# EAGLE schematic OpenPLC (EAGLE 6.5.0)
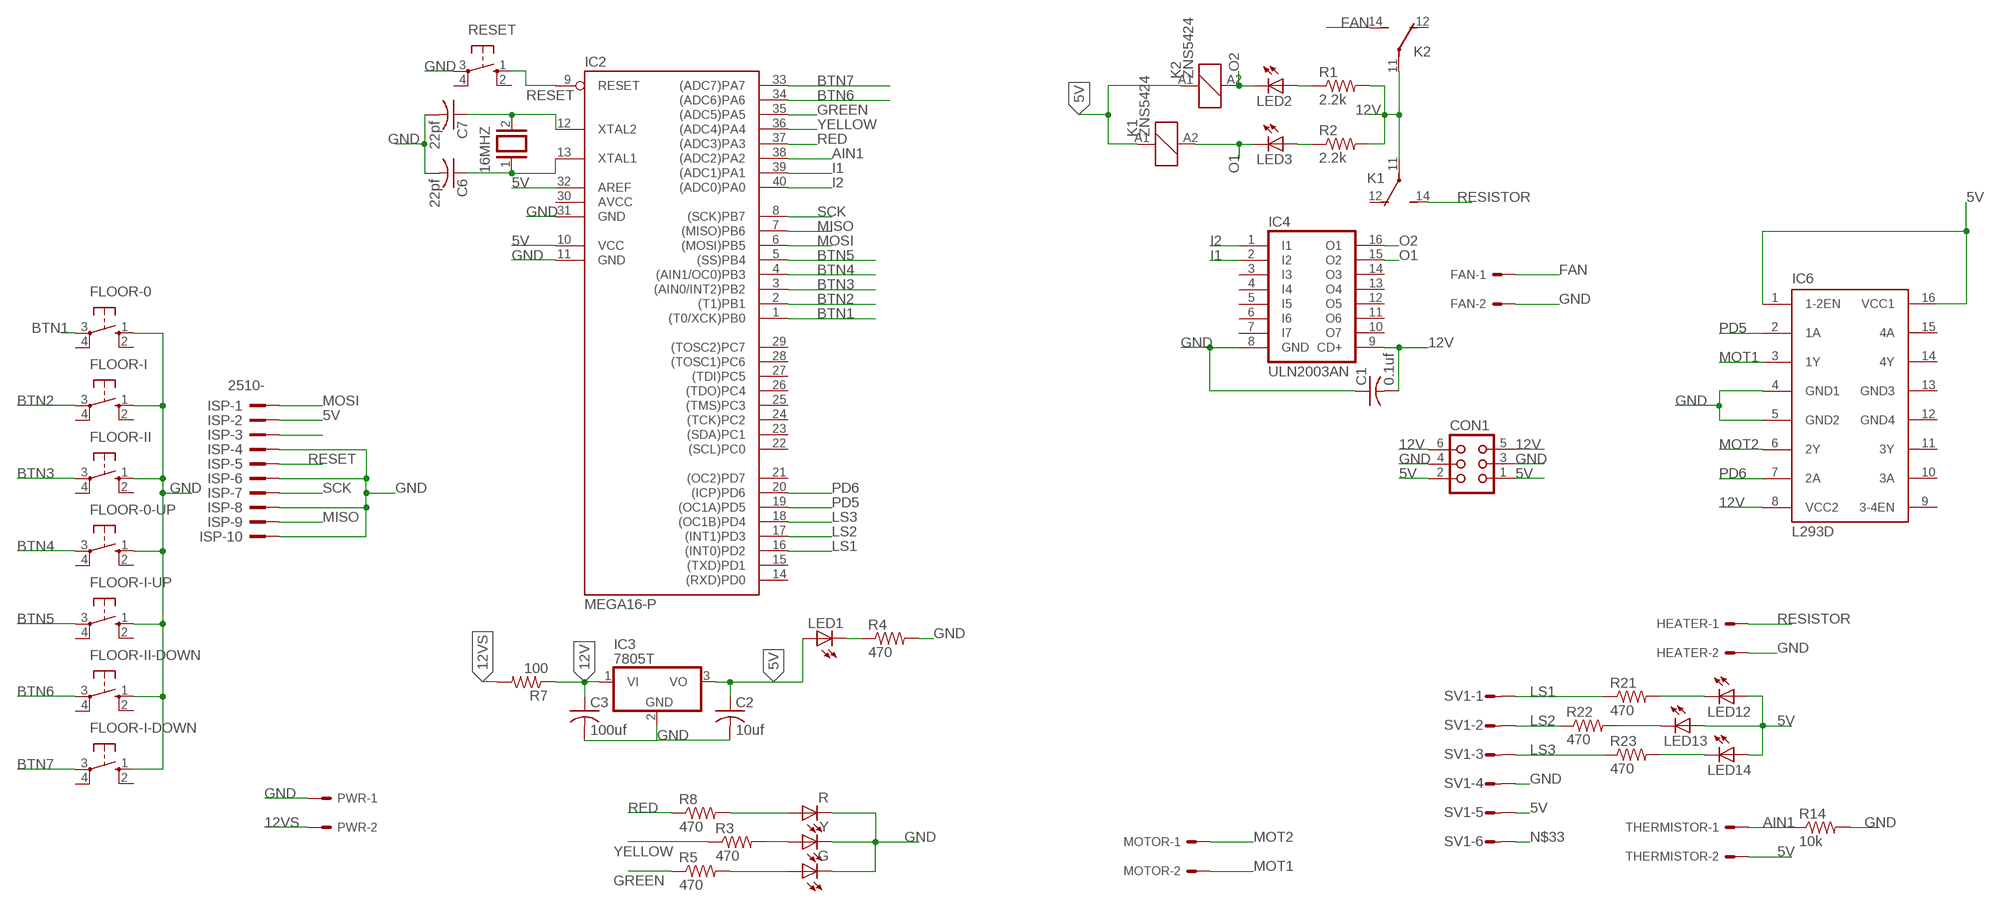
[diagram p0: schematic, sheet 1]

## Parts
16MHZ  XTAL/S  [QS]
C1  0.1uf  C-USC0805  [C0805]
C2  10uf  C-US025-025X050  [C025-025X050]
C3  100uf  C-US025-025X050  [C025-025X050]
C6  22pf  C-USC0805  [C0805]
C7  22pf  C-USC0805  [C0805]
CON1  CON06  [CON06]
FAN  KK-156-2  [KK-156-2]
FLOOR-0  10-XX  [B3F-10XX]
FLOOR-0-UP  10-XX  [B3F-10XX]
FLOOR-I  10-XX  [B3F-10XX]
FLOOR-I-DOWN  10-XX  [B3F-10XX]
FLOOR-I-UP  10-XX  [B3F-10XX]
FLOOR-II  10-XX  [B3F-10XX]
FLOOR-II-DOWN  10-XX  [B3F-10XX]
G  LED10MM  [LED10MM]
HEATER  KK-156-2  [KK-156-2]
IC2  MEGA16-P  [DIL40]
IC3  7805T  [TO220H]
IC4  ULN2003AN  [DIL16]
IC6  L293D  [DIL16]
ISP  2510-  [PAK100/2500-10]
K1  ZNS5424  [ZN5]
K2  ZNS5424  [ZN5]
LED1  LEDSML0805  [SML0805]
LED2  LEDSML0805  [SML0805]
LED3  LEDSML0805  [SML0805]
LED12  LEDSML0805  [SML0805]
LED13  LEDSML0805  [SML0805]
LED14  LEDSML0805  [SML0805]
MOTOR  KK-156-2  [KK-156-2]
PWR  KK-156-2  [KK-156-2]
R  LED10MM  [LED10MM]
R1  2.2k  R-US_R0805  [R0805]
R2  2.2k  R-US_R0805  [R0805]
R3  470  R-US_R0805  [R0805]
R4  470  R-US_R0805  [R0805]
R5  470  R-US_R0805  [R0805]
R7  100  R-US_0207/12  [0207/12]
R8  470  R-US_R0805  [R0805]
R14  10k  R-US_R0805  [R0805]
R21  470  R-US_R0805  [R0805]
R22  470  R-US_R0805  [R0805]
R23  470  R-US_R0805  [R0805]
RESET  10-XX  [B3F-10XX]
SV1  L06P  [L06P]
THERMISTOR  KK-156-2  [KK-156-2]
Y  LED10MM  [LED10MM]

## Nets
5V: C2.1 CON1.1 CON1.2 IC2.10(VCC) IC2.32(AREF) IC3.3(VO) IC6.1(1-2EN) IC6.16(VCC1) ISP.2 K1.A1 K2.A1 LED1.A LED12.A LED13.A LED14.A SV1.5 THERMISTOR.2
12V: C1.2 C3.1 CON1.5 CON1.6 IC3.1(VI) IC4.9(CD+) IC6.8(VCC2) K1.11(2:P) K2.11(2:P) R1.2 R2.2 R7.1
12VS: PWR.2 R7.2
AIN1: IC2.38((ADC2)PA2) R14.1 THERMISTOR.1
BTN1: FLOOR-0.3(P) IC2.1((T0/XCK)PB0)
BTN2: FLOOR-I.3(P) IC2.2((T1)PB1)
BTN3: FLOOR-II.3(P) IC2.3((AIN0/INT2)PB2)
BTN4: FLOOR-0-UP.3(P) IC2.4((AIN1/OC0)PB3)
BTN5: FLOOR-I-UP.3(P) IC2.5((SS)PB4)
BTN6: FLOOR-II-DOWN.3(P) IC2.34((ADC6)PA6)
BTN7: FLOOR-I-DOWN.3(P) IC2.33((ADC7)PA7)
FAN: FAN.1 K2.14(2:S)
G: G.A R5.2
GND: C1.1 C2.2 C3.2 C6.2 C7.2 CON1.3 CON1.4 FAN.2 FLOOR-0-UP.1(S) FLOOR-0.1(S) FLOOR-I-DOWN.1(S) FLOOR-I-UP.1(S) FLOOR-I.1(S) FLOOR-II-DOWN.1(S) FLOOR-II.1(S) G.K(C) HEATER.2 IC2.11(GND) IC2.31(GND) IC3.2(GND) IC4.8(GND) IC6.4(GND1) IC6.5(GND2) ISP.4 ISP.6 ISP.8 ISP.10 PWR.1 R4.2 R14.2 R.K(C) RESET.3(P) SV1.4 Y.K(C)
GREEN: IC2.35((ADC5)PA5) R5.1
I1: IC2.39((ADC1)PA1) IC4.2(I2)
I2: IC2.40((ADC0)PA0) IC4.1(I1)
LS1: IC2.16((INT0)PD2) R21.1 SV1.1
LS2: IC2.17((INT1)PD3) R22.1 SV1.2
LS3: IC2.18((OC1B)PD4) R23.1 SV1.3
MISO: IC2.7((MISO)PB6) ISP.9
MOSI: IC2.6((MOSI)PB5) ISP.1
MOT1: IC6.3(1Y) MOTOR.2
MOT2: IC6.6(2Y) MOTOR.1
N$1: LED1.C R4.1
N$3: ISP.3
N$8: LED2.A R1.1
N$9: LED3.A R2.1
N$17: LED12.C R21.2
N$28: LED13.C R22.2
N$30: LED14.C R23.2
N$31: 16MHZ.1 C6.1 IC2.13(XTAL1)
N$32: 16MHZ.2 C7.1 IC2.12(XTAL2)
N$33: SV1.6
O1: IC4.15(O2) K1.A2 LED3.C
O2: IC4.16(O1) K2.A2 LED2.C
PD5: IC2.19((OC1A)PD5) IC6.2(1A)
PD6: IC2.20((ICP)PD6) IC6.7(2A)
R: R8.2 R.A
RED: IC2.37((ADC3)PA3) R8.1
RESET: IC2.9(RESET) ISP.5 RESET.1(S)
RESISTOR: HEATER.1 K1.14(2:S)
SCK: IC2.8((SCK)PB7) ISP.7
Y: R3.2 Y.A
YELLOW: IC2.36((ADC4)PA4) R3.1
Unconnected: FLOOR-0-UP.2(S1) FLOOR-0-UP.4(P1) FLOOR-0.2(S1) FLOOR-0.4(P1) FLOOR-I-DOWN.2(S1) FLOOR-I-DOWN.4(P1) FLOOR-I-UP.2(S1) FLOOR-I-UP.4(P1) FLOOR-I.2(S1) FLOOR-I.4(P1) FLOOR-II-DOWN.2(S1) FLOOR-II-DOWN.4(P1) FLOOR-II.2(S1) FLOOR-II.4(P1) IC2.14((RXD)PD0) IC2.15((TXD)PD1) IC2.21((OC2)PD7) IC2.22((SCL)PC0) IC2.23((SDA)PC1) IC2.24((TCK)PC2) IC2.25((TMS)PC3) IC2.26((TDO)PC4) IC2.27((TDI)PC5) IC2.28((TOSC1)PC6) IC2.29((TOSC2)PC7) IC4.3(I3) IC4.4(I4) IC4.5(I5) IC4.6(I6) IC4.7(I7) IC4.10(O7) IC4.11(O6) IC4.12(O5) IC4.13(O4) IC4.14(O3) IC6.9(3-4EN) IC6.10(3A) IC6.11(3Y) IC6.14(4Y) IC6.15(4A) K1.12(2:O) K2.12(2:O) RESET.2(S1) RESET.4(P1)

## Power pins joined to a net without a drawn wire
AVCC: IC2.30(AVCC)
GND3: IC6.13(GND3)
GND4: IC6.12(GND4)

## Library data of the parts
16MHZ = special:XTAL/S: CRYSTAL
C1-C3 C6 C7 = rcl:C-US: CAPACITOR, American symbol
CON1 = con-harting:CON06: CONNECTOR; OC_FARNELL: unknown; OC_NEWARK: unknown
FAN HEATER MOTOR PWR THERMISTOR = con-molex:KK-156-2: KK 156 HEADER Source: http://www.molex.com/pdm_docs/sd/026604100_sd.pdf; OC_FARNELL: unknown; OC_NEWARK: unknown
FLOOR-0 FLOOR-0-UP FLOOR-I FLOOR-I-DOWN FLOOR-I-UP FLOOR-II FLOOR-II-DOWN RESET = switch-omron:10-XX: OMRON SWITCH; MPN: B3F-1000; OC_FARNELL: 176432; OC_NEWARK: 36M3542
G LED1-LED3 LED12-LED14 R Y = led:LED: LED OSRAM: - CHIPLED LG R971, LG N971, LY N971, LG Q971, LY Q971, LO R971, LY R971 LH N974, LH R974 LS Q976, LO Q976, LY Q976 LO Q996 - Hyper CHIPLED LW Q18S LB Q993, LB Q99A, LB R99A - SideLED LS A670, LO A670, LY A670, LG A670, LP A670 LB A673, LV A673, LT A673, LW A673 LH A674 LY A675 LS A676, LA A676, LO A676, LY A676, LW A676 LS A679, LY A679, LG A679 - Hyper Micro SIDELED® LS Y876, LA Y876, LO Y876, LY Y876 LT Y87S - SmartLED LW L88C, LW L88S LB L89C, LB L89S, LG L890 LS L89K, LO L89K, LY L89K LS L896, LA L896, LO L896, LY L896 - TOPLED LS T670, LO T670, LY T670, LG T670, LP T670 LSG T670, LSP T670, LSY T670, LOP T670, LYG T670 LG T671, LOG T671, LSG T671 LB T673, LV T673, LT T673, LW T673 LH T674 LS T676, LA T676, LO T676, LY T676, LB T676, LH T676, LSB T676, LW T676 LB T67C, LV T67C, LT T67C, LS T67K, LO T67K, LY T67K, LW E67C LS E67B, LA E67B, LO E67B, LY E67B, LB E67C, LV E67C, LT E67C LW T67C LS T679, LY T679, LG T679 LS T770, LO T770, LY T770, LG T770, LP T770 LB T773, LV T773, LT T773, LW T773 LH T774 LS E675, LA E675, LY E675, LS T675 LS T776, LA T776, LO T776, LY T776, LB T776 LHGB T686 LT T68C, LB T68C - Hyper Mini TOPLED® LB M676 - Mini TOPLED Santana® LG M470 LS M47K, LO M47K, LY M47K Source: http://www.osram.convergy.de LUXEON: - LUMILED® LXK2-PW12-R00, LXK2-PW12-S00, LXK2-PW14-U00, LXK2-PW14-V00 LXK2-PM12-R00, LXK2-PM12-S00, LXK2-PM14-U00 LXK2-PE12-Q00, LXK2-PE12-R00, LXK2-PE12-S00, LXK2-PE14-T00, LXK2-PE14-U00 LXK2-PB12-K00, LXK2-PB12-L00, LXK2-PB12-M00, LXK2-PB14-N00, LXK2-PB14-P00, LXK2-PB14-Q00 LXK2-PR12-L00, LXK2-PR12-M00, LXK2-PR14-Q00, LXK2-PR14-R00 LXK2-PD12-Q00, LXK2-PD12-R00, LXK2-PD12-S00 LXK2-PH12-R00, LXK2-PH12-S00 LXK2-PL12-P00, LXK2-PL12-Q00, LXK2-PL12-R00 Source: www.luxeon.com KINGBRIGHT: KA-3528ASYC Source: www.kingbright.com
IC2 = atmel:MEGA16-P: MICROCONTROLLER 16 Kbytes FLASH 1 kbytes SRAM 512 bytes EEPROM USART 8-channel 10 bit ADC Source: avr.lbr; MPN: ATMEGA16-16PU; OC_FARNELL: 9171142; OC_NEWARK: 01M6885
IC3 = linear:78*: Positive VOLTAGE REGULATOR Source: http://cache.national.com/ds/LM/LM78L05.pdf http://www.fairchildsemi.com/ds/LM/LM7805.pdf
IC4 = uln-udn:ULN2003A: DRIVER ARRAY
IC6 = st-microelectronics:L293D: PUSH-PULL 4 CHANNEL DRIVER; MPN: L293D; OC_FARNELL: 9589619; OC_NEWARK: 56P8249
ISP = con-3m:2510-: 3M (TM) Pak 100 4-Wall Header Source: 3M; MF: 3M; MPN: 2510-6002UB; OC_FARNELL: 9838244; OC_NEWARK: 46F4725
K1 K2 = relay:ZNS5*: Miniature Power PCB Relay SCHRACK 1pole 10 A Source: http://www.schrack.com/.. 5847.pdf; OC_FARNELL: unknown; OC_NEWARK: unknown
R1-R5 R7 R8 R14 R21-R23 = resistor:R-US_: RESISTOR, American symbol
SV1 = con-amp-mt:L06P: AMP MT CONNECTOR; OC_FARNELL: unknown; OC_NEWARK: unknown